# EAGLE design odessa_rev_A (EAGLE 6.6.0)
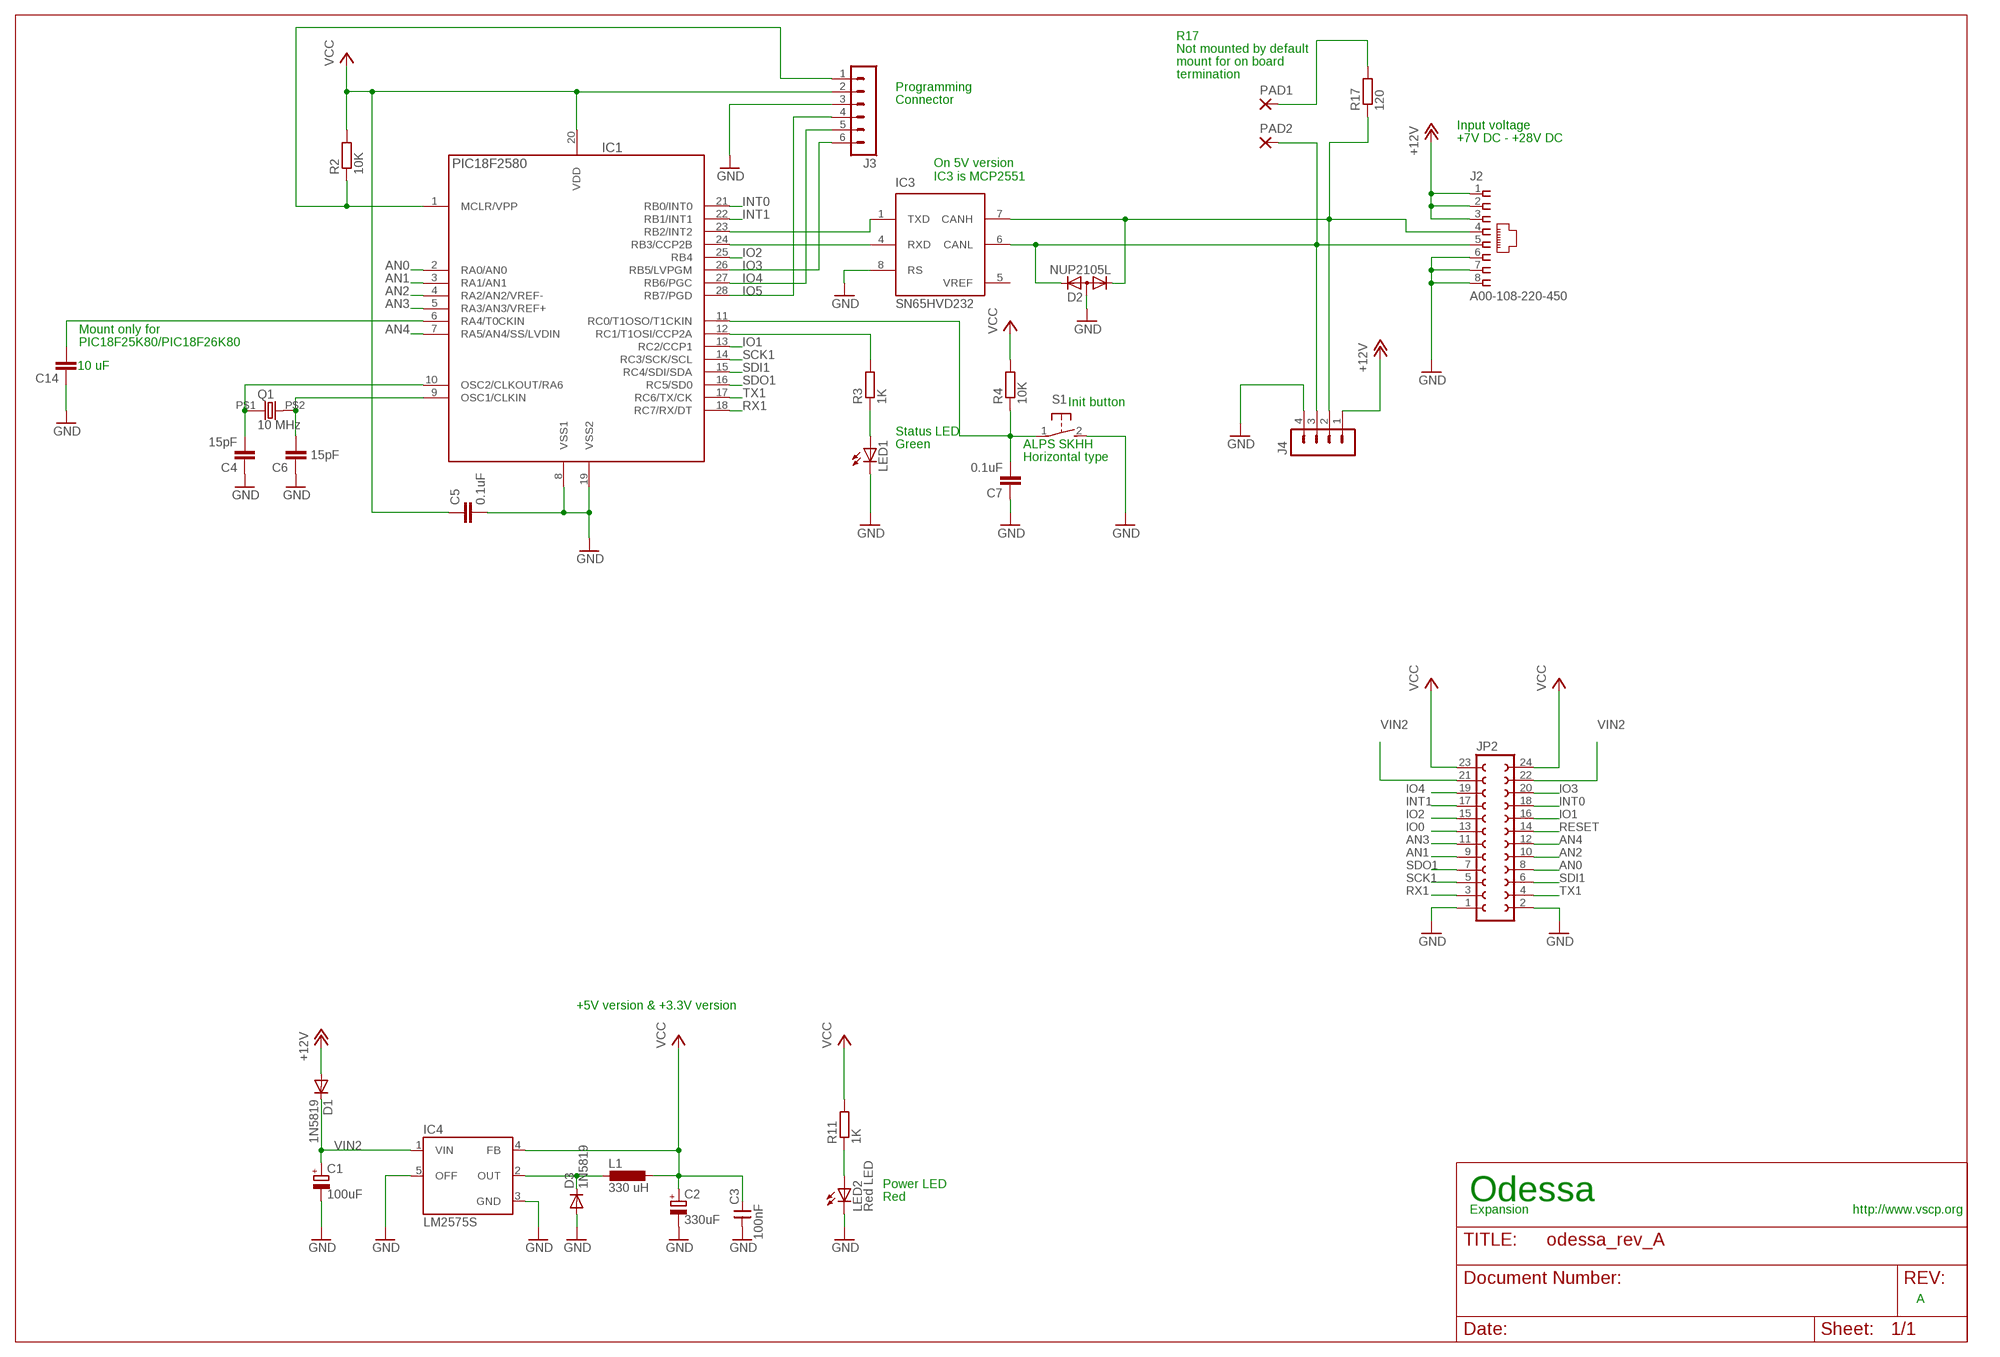
[diagram p0: schematic, sheet 1]

## Parts
C1  100uF  CPOL-EUD  [PANASONIC_D]
C2  330uF  CPOL-EUD  [PANASONIC_D]
C3  100nF  CNP-0805  [0805]
C4  15pF  C-EUC0805  [C0805]
C5  0.1uF  C-EUC0805  [C0805]
C6  15pF  C-EUC0805  [C0805]
C7  0.1uF  C-EUC0805  [C0805]
C14  10 uF  C-EUC0805  [C0805]
D1  1N5819  DIODE-SOD123  [SOD123]
D2  NUP2105L  DIODE-2CA|ACSOT23  [SOT23]
D3  1N5819  DIODE-SOD123  [SOD123]
IC1  PIC18F2580  PIC18LF252-I/SO  [SO28]
IC3  SN65HVD232  MCP2551SN  [SO-08]
IC4  LM2575S  [TO263-5]
J2  A00-108-220-450  [RJ-45]
J3  MA06-1  [MA06-1]
J4  MA04-1  [MA04-1]
JP2  FE12-2  [FE12-2]
L1  330 uH  DO3316P  [DO3316P]
LED1  LEDCHIP-LED0805  [CHIP-LED0805]
LED2  Red LED  LEDCHIP-LED0805  [CHIP-LED0805]
PAD1  1,6/0,8  [1,6/0,8]
PAD2  1,6/0,8  [1,6/0,8]
Q1  10 MHz  HC-49S  [9C]
R2  10K  R-EU_R0805  [R0805]
R3  1K  R-EU_R0805  [R0805]
R4  10K  R-EU_R0805  [R0805]
R11  1K  R-EU_R0805  [R0805]
R17  120  R-EU_R0805  [R0805]
S1  31-XX  [B3F-31XX]

## Nets
+12V: D1.A J2.1 J2.2 J2.3 J4.1
AN0: IC1.2(RA0/AN0) JP2.8
AN1: IC1.3(RA1/AN1) JP2.9
AN2: IC1.4(RA2/AN2/VREF-) JP2.10
AN3: IC1.5(RA3/AN3/VREF+) JP2.11
AN4: IC1.7(RA5/AN4/SS/LVDIN) JP2.12
CANL: D2.2(K2) IC3.6(CANL) J2.5 J4.3 PAD2.1(P)
GND: C1.- C2.- C3.1 C4.1 C5.2 C6.1 C7.1 C14.1 D2.3(A) D3.A IC1.8(VSS1) IC1.19(VSS2) IC3.8(RS) IC4.3(GND) IC4.5(OFF) J2.6 J2.7 J2.8 J3.3 J4.4 JP2.1 JP2.2 LED1.C LED2.C S1.2(S)
INT0: IC1.21(RB0/INT0) JP2.18
INT1: IC1.22(RB1/INT1) JP2.17
IO0: JP2.13
IO1: IC1.13(RC2/CCP1) JP2.16
IO2: IC1.25(RB4) JP2.15
IO3: IC1.26(RB5/LVPGM) J3.6 JP2.20
IO4: IC1.27(RB6/PGC) J3.5 JP2.19
IO5: IC1.28(RB7/PGD) J3.4
N$1: D3.C IC4.2(OUT) L1.1
N$2: C4.2 IC1.10(OSC2/CLKOUT/RA6) Q1.P$1
N$3: C14.2 IC1.6(RA4/T0CKIN)
N$4: IC1.12(RC1/T1OSI/CCP2A) R3.2
N$5: LED1.A R3.1
N$6: C7.2 IC1.11(RC0/T1OSO/T1CKIN) R4.1 S1.1(P)
N$7: C6.2 IC1.9(OSC1/CLKIN) Q1.P$2
N$11: PAD1.1(P) R17.2
N$20: LED2.A R11.1
N$22: D2.1(K1) IC3.7(CANH) J2.4 J4.2 R17.1
RESET: IC1.1(MCLR/VPP) J3.1 JP2.14 R2.1
RX1: IC1.18(RC7/RX/DT) JP2.3
RXCAN: IC1.24(RB3/CCP2B) IC3.4(RXD)
SCK1: IC1.14(RC3/SCK/SCL) JP2.5
SDI1: IC1.15(RC4/SDI/SDA) JP2.6
SDO1: IC1.16(RC5/SD0) JP2.7
TX1: IC1.17(RC6/TX/CK) JP2.4
TXCAN: IC1.23(RB2/INT2) IC3.1(TXD)
VCC: C2.+ C3.2 C5.1 IC1.20(VDD) IC4.4(FB) J3.2 JP2.23 JP2.24 L1.2 R2.2 R4.2 R11.2
VIN2: C1.+ D1.C IC4.1(VIN) JP2.21 JP2.22

## Notes on the sheet
- R17
- Not mounted by default
- mount for on board
- termination
- Programming
- Connector
- Input voltage
- +7V DC - +28V DC
- On 5V version 
  IC3 is MCP2551
- Mount only for
- PIC18F25K80/PIC18F26K80
- Init button
- Status LED
- Green | ALPS SKHH
- Horizontal type
- +5V version & +3.3V version
- Power LED
- Red | Odessa
- Expansion | http://www.vscp.org
- A

## Power pins joined to a net without a drawn wire
GND: IC3.2(VSS)
VCC: IC3.3(VDD)
VREF: IC3.5(VREF)

## Library data of the parts
C1 C2 = rcl:CPOL-EU: POLARIZED CAPACITOR, European symbol
C3 = cap-master:CNP-: NON-POLARIZED CAP
C4-C7 C14 = rcl:C-EU: CAPACITOR, European symbol
D1 D3 = diode:DIODE-: DIODE
D2 = diode:DIODE-2CA|AC: Dual DIODE Cathode-Anode|Anode-Cathode
IC1 = pic_olin:PIC18*F252-?: 18F252, 28 pin, 32Kb prog, 1536 data, 256 EEPROM
IC3 = microchip_can:MCP2551: High Speed CAN tranceiver
IC4 = v-reg-3:LM2575: National Semiconductor <http://www.national.com> 1.0A "Simple Switcher"(c) 52kHz, Vout 1.23-37V (HV: 57V), Vin 40V (HV: 60V), 50µA standby current
J2 = vscpcan:A00-108-220-450
J3 = con-lstb:MA06-1: PIN HEADER; OC_FARNELL: unknown; OC_NEWARK: unknown
J4 = con-lstb:MA04-1: PIN HEADER; OC_FARNELL: unknown; OC_NEWARK: unknown
JP2 = con-lsta:FE12-2: FEMALE HEADER; OC_FARNELL: unknown; OC_NEWARK: unknown
L1 = inductor-coilcraft:DO3316P: COILCRAFT; OC_FARNELL: unknown; OC_NEWARK: unknown
LED1 LED2 = led:LED: LED OSRAM: - CHIPLED LG R971, LG N971, LY N971, LG Q971, LY Q971, LO R971, LY R971 LH N974, LH R974 LS Q976, LO Q976, LY Q976 LO Q996 - Hyper CHIPLED LW Q18S LB Q993, LB Q99A, LB R99A - SideLED LS A670, LO A670, LY A670, LG A670, LP A670 LB A673, LV A673, LT A673, LW A673 LH A674 LY A675 LS A676, LA A676, LO A676, LY A676, LW A676 LS A679, LY A679, LG A679 - Hyper Micro SIDELED® LS Y876, LA Y876, LO Y876, LY Y876 LT Y87S - SmartLED LW L88C, LW L88S LB L89C, LB L89S, LG L890 LS L89K, LO L89K, LY L89K LS L896, LA L896, LO L896, LY L896 - TOPLED LS T670, LO T670, LY T670, LG T670, LP T670 LSG T670, LSP T670, LSY T670, LOP T670, LYG T670 LG T671, LOG T671, LSG T671 LB T673, LV T673, LT T673, LW T673 LH T674 LS T676, LA T676, LO T676, LY T676, LB T676, LH T676, LSB T676, LW T676 LB T67C, LV T67C, LT T67C, LS T67K, LO T67K, LY T67K, LW E67C LS E67B, LA E67B, LO E67B, LY E67B, LB E67C, LV E67C, LT E67C LW T67C LS T679, LY T679, LG T679 LS T770, LO T770, LY T770, LG T770, LP T770 LB T773, LV T773, LT T773, LW T773 LH T774 LS E675, LA E675, LY E675, LS T675 LS T776, LA T776, LO T776, LY T776, LB T776 LHGB T686 LT T68C, LB T68C - Hyper Mini TOPLED® LB M676 - Mini TOPLED Santana® LG M470 LS M47K, LO M47K, LY M47K Source: http://www.osram.convergy.de LUXEON: - LUMILED® LXK2-PW12-R00, LXK2-PW12-S00, LXK2-PW14-U00, LXK2-PW14-V00 LXK2-PM12-R00, LXK2-PM12-S00, LXK2-PM14-U00 LXK2-PE12-Q00, LXK2-PE12-R00, LXK2-PE12-S00, LXK2-PE14-T00, LXK2-PE14-U00 LXK2-PB12-K00, LXK2-PB12-L00, LXK2-PB12-M00, LXK2-PB14-N00, LXK2-PB14-P00, LXK2-PB14-Q00 LXK2-PR12-L00, LXK2-PR12-M00, LXK2-PR14-Q00, LXK2-PR14-R00 LXK2-PD12-Q00, LXK2-PD12-R00, LXK2-PD12-S00 LXK2-PH12-R00, LXK2-PH12-S00 LXK2-PL12-P00, LXK2-PL12-Q00, LXK2-PL12-R00 Source: www.luxeon.com KINGBRIGHT: KA-3528ASYC Source: www.kingbright.com
PAD1 PAD2 = wirepad:1,6/0,8: THROUGH-HOLE PAD
Q1 = vscpcan:HC-49S: Digikey 887-1050-1-nd
R2-R4 R11 R17 = rcl:R-EU_: RESISTOR, European symbol
S1 = switch-omron:31-XX: OMRON SWITCH; MPN: B3F-3100; OC_FARNELL: 959704; OC_NEWARK: 36M3582

## Board
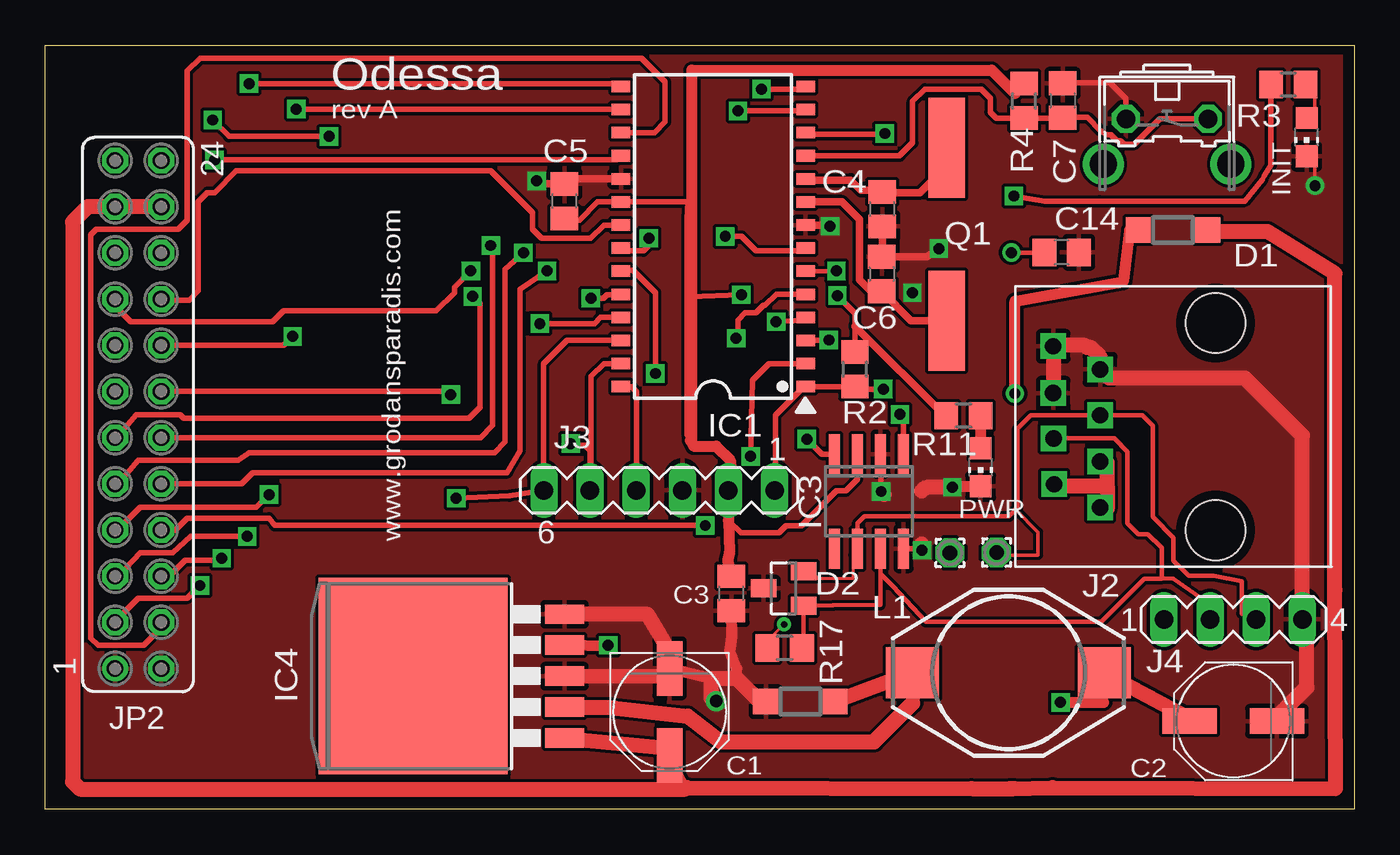
[diagram p1: board, top side]
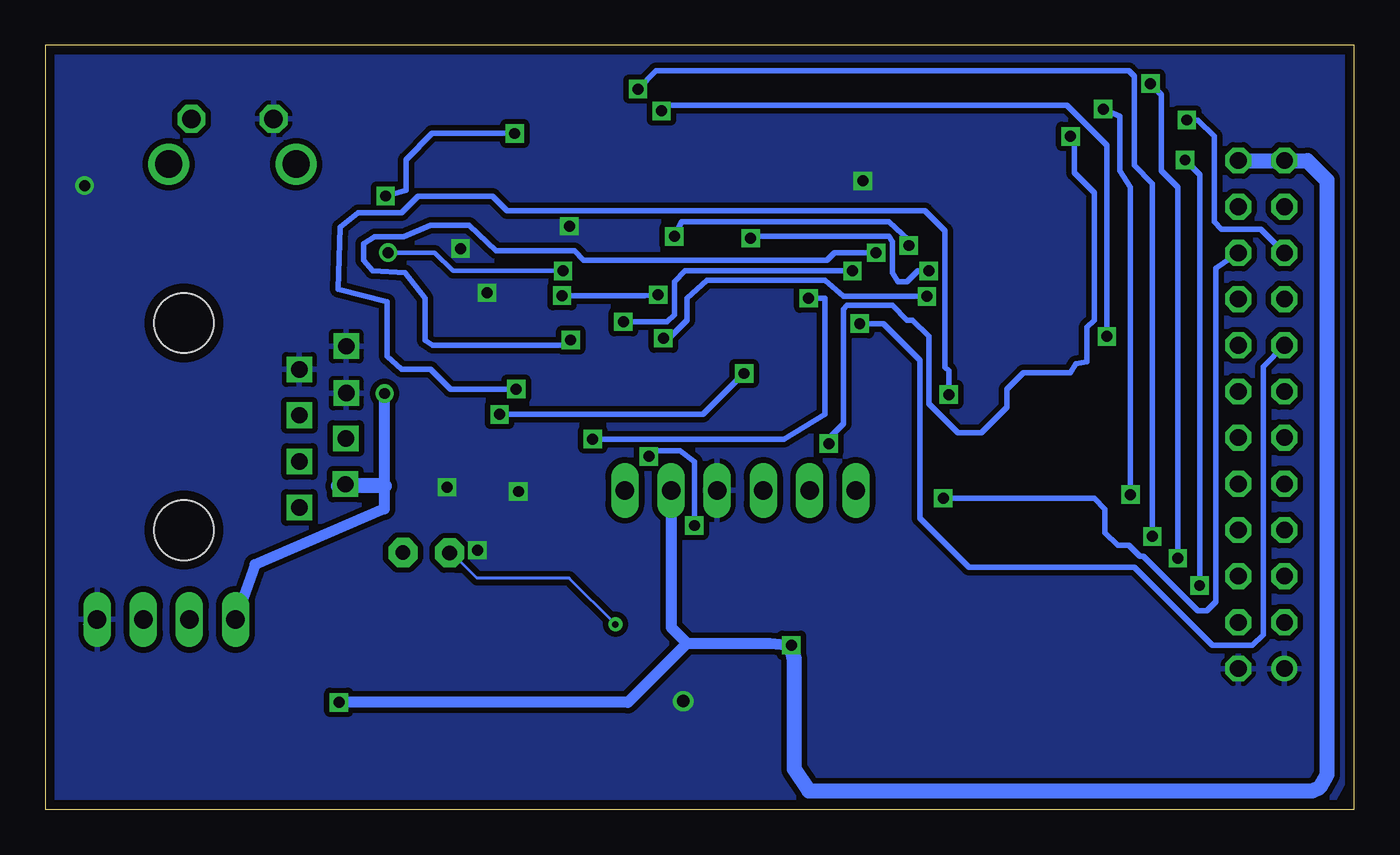
[diagram p2: board, bottom side, seen from below]

Size 72 x 42 mm. Coordinates in mm from the lower left corner, seen from the top.
Outline: 0,0 0,42 72,42 72,0 0,0
Copper layers (1*16): Top 0.0356mm / dielectric 1.5011mm / Bottom 0.0356mm
Design rules "SilverCircuits": minimum track width 7mil, minimum drill 14mil, track to track 7mil, track to pad 7mil, pad to pad 7mil, via to via 7mil, smd to smd 0mil, copper to edge 20mil, drill to drill 8mil, minimum pad ring 10mil, minimum via ring 8mil, stop-mask expansion 4mil, vias tented up to drill 0mil, thermal gap 10mil

### Footprints (pad centres in the part's own frame; a part is rotated, then mirrored left to right if it is on the bottom)
PANASONIC_D = smd 3 x 1.4: + 2.4,0; - -2.4,0
0805 = smd 1.27 x 1.524: 1 -0.953,0; 2 0.953,0
C0805 = smd 1.3 x 1.5: 1 -0.95,0; 2 0.95,0
SOD123 = smd 1.4 x 1.4: A 1.9,0; C -1.9,0
SOT23 = smd 1 x 1.4: 1 -0.95,-1.1; 2 0.95,-1.1; 3 0,1.1
SO28 = smd 0.635 x 1.016: 1 -8.255,-5.08; 2 -6.985,-5.08; 3 -5.715,-5.08; 4 -4.445,-5.08; 5 -3.175,-5.08; 6 -1.905,-5.08; 7 -0.635,-5.08; 8 0.635,-5.08; 9 1.905,-5.08; 10 3.175,-5.08; 11 4.445,-5.08; 12 5.715,-5.08; 13 6.985,-5.08; 14 8.255,-5.08; 15 8.255,5.08; 16 6.985,5.08; 17 5.715,5.08; 18 4.445,5.08; 19 3.175,5.08; 20 1.905,5.08; 21 0.635,5.08; 22 -0.635,5.08; 23 -1.905,5.08; 24 -3.175,5.08; 25 -4.445,5.08; 26 -5.715,5.08; 27 -6.985,5.08; 28 -8.255,5.08
SO-08 = smd 0.6 x 2.2: 1 -1.905,-2.6; 2 -0.635,-2.6; 3 0.635,-2.6; 4 1.905,-2.6; 5 1.905,2.6; 6 0.635,2.6; 7 -0.635,2.6; 8 -1.905,2.6
TO263-5 = smd 1.067 x 2.159: 1 -3.404,-5.791; 2 -1.702,-5.791; 3 0,-5.791; 4 1.702,-5.791; 5 3.404,-5.791 | smd 10.8 x 10.41: 6 0,2.54
RJ-45 = drill 0.9 square: 1 -4.45,6.35; 2 -3.17,8.89; 3 -1.92,6.36; 4 -0.65,8.91; 5 0.62,6.35; 6 1.84,8.93; 7 3.14,6.35; 8 4.42,8.93 | hole 3.3: -5.7,0; 5.7,0
MA06-1 = drill 1.016 long: 1 -6.35,0; 2 -3.81,0; 3 -1.27,0; 4 1.27,0; 5 3.81,0; 6 6.35,0
MA04-1 = drill 1.016 long: 1 -3.81,0; 2 -1.27,0; 3 1.27,0; 4 3.81,0
FE12-2 = drill 0.914: 1 -13.97,1.27 | drill 0.914 octagon: 2 -13.97,-1.27; 3 -11.43,1.27; 4 -11.43,-1.27; 5 -8.89,1.27; 6 -8.89,-1.27; 7 -6.35,1.27; 8 -6.35,-1.27; 9 -3.81,1.27; 10 -3.81,-1.27; 11 -1.27,1.27; 12 -1.27,-1.27; 13 1.27,1.27; 14 1.27,-1.27; 15 3.81,1.27; 16 3.81,-1.27; 17 6.35,1.27; 18 6.35,-1.27; 19 8.89,1.27; 20 8.89,-1.27; 21 11.43,1.27; 22 11.43,-1.27; 23 13.97,1.27; 24 13.97,-1.27
DO3316P = smd 2.92 x 2.79: 1 -5.28,0; 2 5.28,0
CHIP-LED0805 = smd 1.2 x 1.2: A 0,-1.05; C 0,1.05
1,6/0,8 = drill 0.813 pad 1.6 octagon: 1 0,0
9C = smd 5.5 x 2: P$1 -4.74,0; P$2 4.76,0
R0805 = smd 1.3 x 1.5: 1 -0.95,0; 2 0.95,0
B3F-31XX = drill 1.016 octagon: 1 -2.261,-1.245; 2 2.261,-1.245 | drill 1.499 pad 2.159: 3 -3.505,1.245; 4 3.505,1.245

### Placement (x,y rotation side)
C1  34.34,5.34 270 top
C2  65.36,4.84 180 top
C3  37.74,11.86 90 top
C4  46.04,33 90 top
C5  28.55,33.44 90 top
C6  46.01,29.43 270 top
C7  55.97,38.97 270 top
C14  55.91,30.62 180 top
D1  62.04,31.86 180 top
D2  40.61,12.14 90 top
D3  41.53,5.91 180 top
IC1  36.74,31.49 90 top
IC3  45.31,16.93 180 top
IC4  22.77,7.31 90 top
J2  64.38,21.04 90 top
J3  33.77,17.53 180 top
J4  65.35,10.43 0 top
JP2  5.1,21.7 90 top
L1  52.99,7.5 0 top
LED1  69.39,36.96 180 top
LED2  51.45,18.8 180 top
PAD1  49.76,14.09 0 top
PAD2  52.33,14.11 0 top
Q1  49.58,31.63 270 top
R2  44.54,24.19 90 top
R3  68.38,39.85 180 top
R4  53.84,38.95 90 top
R11  50.51,21.64 180 top
R17  40.67,8.86 180 top
S1  61.71,36.72 180 top

### Tracks (layer width: path | path; a pad name or v marks a point on that pad's centre or on a via)
+12V  (via drill 0.6)
  Top 0.178: 59.69,31.75 59.66,31.86
  Top 0.203: J2.2 55.88,17.78 | 58.42,16.51 J2.1 | 59.69,31.75 D1.A
  Top 0.406: D1.A 59.82,31.84
  Top 0.61: 60.01,31.97 59.66,31.86 59.67,31.77 59.33,29.06 59.27,29.01 53.34,27.94 v53.34,22.86
  Top 0.813: 55.88,17.78 58.42,17.78 | 58.42,17.78 58.42,19.05 J2.3 | 58.42,17.78 58.42,16.51
  Bottom 0.203: 55.88,17.78 J2.2
  Bottom 0.61: v53.34,22.86 53.34,17.78 53.34,16.51 60.47,13.44 J4.1
  Bottom 0.813: 53.34,17.78 55.88,17.78
AN0  (via drill 0.6)
  Top 0.305: JP2.8 7.15,15.35 7.8,16 12.3,16 12.6,15.6 v36.3,15.6 | v38.8,19.4 38.9,23.6 39.8,24.5 IC1.2
  Bottom 0.305: v36.3,15.6 36.3,19.1 37.1,19.7 38.5,19.7 v38.8,19.4
AN1  (via drill 0.6)
  Top 0.305: JP2.9 3.99,17.89 5.1,19.2 10.6,19.2 11.2,19.6 24.7,19.6 25.3,20.2 25.3,29.7 v26.3,30.6 | v43.1,25.8 41.84,25.8 IC1.3
  Bottom 0.305: v26.3,30.6 28.6,30.6 29,30.2 42.4,30.2 42.9,30.7 47.2,30.7 48.7,32.1 50.8,32.1 52.3,31.49 53.9,31.49 54.5,31.1 54.5,30.2 54,29.6 52.2,29.5 51.1,28.1 51.1,25.8 50.7,25.5 43.4,25.5 v43.1,25.8
AN2  (via drill 0.6)
  Top 0.305: JP2.10 10.79,17.89 11.4,18.5 25.4,18.5 26.1,19.7 26.1,28.6 v27.6,29.6 | v40.2,26.8 41.67,26.9 IC1.4
  Bottom 0.305: v27.6,29.6 36.8,29.6 37.4,29 37.4,27.2 37.8,26.8 v40.2,26.8
AN3  (via drill 0.6)
  Top 0.305: JP2.11 3.93,20.43 5,21.7 7.4,21.7 7.6,21.5 23.3,21.5 23.9,22.1 23.9,27.8 v23.5,28.2 | IC1.5 40.22,28.32 39.6,27.7 39.5,27.7 39.1,27.3 38.5,27.3 38.1,26.9 38.1,26 v38,25.9
  Bottom 0.305: v23.5,28.2 28.1,28.2 29.1,29.1 35.6,29.1 36.7,28.1 36.7,26.9 37.7,25.9 v38,25.9
AN4  (via drill 0.6)
  Top 0.305: JP2.12 23.93,20.43 24.6,21.1 24.6,30.5 v24.5,31 | v37.4,31.5 38.3,31.5 39.1,30.7 41.66,30.7 IC1.7
  Bottom 0.305: v24.5,31 24.5,31.3 25.6,32.3 37,32.3 v37.4,31.5
CANL
  Top 0.178: 44.45,13.97 44.45,12.7 41.91,12.7 D2.2
  Top 0.203: D2.2 42.45,12.74 | 44.45,13.97 IC3.6 | PAD2.1 52.07,13.97 54.61,13.97 54.61,15.24 53.38,16.46 53.34,16.51
  Top 0.254: J4.3 65.81,10.75 65.81,12.53 64.29,12.83 62.9,12.83 62.06,13.67 62.06,14.93 60.92,16.07 60.92,21.09 60.35,21.66 J2.5 54.21,21.66 53.48,20.93 53.48,16.56 53.38,16.46 53.02,16.1 45.06,16.1 44.67,15.71 IC3.6
GND  (via drill 0.6, 0.7)
  Top 0.203: v69.85,34.29 69.85,35.56 LED1.C
  Top 0.254: 36.63,7.18 36.63,7.36
  Top 0.305: IC3.8 48.14,14.33 v48.23,14.24 | v45.98,17.47 45.98,19.5 IC3.2 | S1.2 59.45,39.06 58.55,39.96 56.01,39.96 C7.1
  Top 0.406: IC1.19 28.82,34.66 C5.2 27.19,34.39 v27.03,34.55 | 45.97,32.12 C4.1 46.04,30.41 C6.1 48.51,30.38 v49.16,30.83 | IC1.8 43.1,32.12 v43.17,32.06
  Top 0.61: 34.05,7.32 34.33,6.65 34.62,7.21 34.65,7.18 | 34.65,7.18 34.7,7.13 | 34.65,7.18 C1.- | 39.42,5.79 39.33,5.88 D3.A 39.48,5.91 | C1.- 36.63,7.18 | 39.48,5.91 39.58,5.81 | 39.48,5.91 38.93,6.46 | 34.44,7.15 34.34,7.05 | C1.- 34.44,7.15 | 34.47,8.45 34.47,7.18 34.44,7.15 | 36.63,6.09 v36.91,5.94 | 38.02,7.18 38.02,7.75 37.66,8.68 37.76,9.48 C3.1 | 49.95,17.75 LED2.C
  Top 0.813: IC4.3 34.05,7.32 | 39.33,5.88 38.02,7.18 36.63,7.18 36.63,6.09 | IC4.5 33.14,10.71 34.47,8.45 | C2.- 67.76,5.06 69.4,6.7 69.4,10.19 J4.4 69.16,20.54 66,23.7 58.51,23.7 J2.7 58.03,24.87 57.5,25.4 57.3,25.4 57.2,25.5 55.49,25.5 J2.8 J2.6 | v49.9,17.7 48.5,17.7 48.2,17.5 | 46.15,17.3 v45.98,17.47 | 48.2,14.57 v48.23,14.24
  Bottom 0.178: 43.18,31.75 v43.17,32.06 | J4.4 69.85,10.16 69.26,10.33
  other vias: 47.7,28.4
  pour Bottom (isolate 0.305): 0.5,1.58 1.26,0.23 71.64,0.46 71.48,1.13 71.5,34.3 71.42,41.86 0.33,41.86 0.51,33.68
  pour Top: 0.57,41.92 0.56,41.52 0.56,0.32 71.6,0.32 71.6,0.81 71.28,0.81 71.28,41.6 2.5,41.9 2.1,41.85
INT0
  Top 0.305: IC1.21 30.73,32.12 30,31.4 27.3,31.4 26.8,31.9 26.8,32.8 24.5,35.1 10.5,35.1 9.3,33.9 8.9,33.9 8.4,33.4 8.4,28.5 7.9,28 6.42,28 JP2.18
INT1  (via drill 0.6)
  Top 0.305: JP2.17 3.83,27.67 4.7,26.8 12.5,26.8 13.1,27.4 21.5,27.4 22.5,28.4 22.5,28.7 v23.4,29.6 | v33.2,31.4 33.2,31 32.9,30.7 31.82,30.7 IC1.22
  Bottom 0.305: v23.4,29.6 24,29.6 24.6,29 25.1,29 25.4,29.5 25.4,31.2 25.6,31.5 32.8,31.5 v33.2,31.4
IO1  (via drill 0.6)
  Top 0.305: JP2.16 13.11,25.51 v13.6,26 | v38.1,38.4 41.74,38.4 IC1.13
  Bottom 0.305: v13.6,26 13.6,36.5 15.8,38.7 37.8,38.7 v38.1,38.4
IO2  (via drill 0.6)
  Top 0.305: IC1.25 30.55,27.05 30.2,26.7 v27.2,26.7
  Bottom 0.305: v27.2,26.7 25.9,26.7 23.9,24.7 23.9,16 21.2,13.3 12.1,13.3 7.8,9 5.6,9 5,9.6 5,24.34 JP2.15
IO3  (via drill 0.6)
  Top 0.305: IC1.26 28.68,25.77 27.41,24.5 J3.6 25.53,17.23 v22.6,17.1
  Bottom 0.305: v22.6,17.1 14.3,17.1 13.7,16.5 13.7,15.2 13,14.5 12.4,14.5 11.8,13.9 11.6,13.9 8.6,10.9 8.1,10.9 7.6,11.4 7.6,29.76 JP2.20
IO4  (via drill 0.6)
  Top 0.305: IC1.27 30.73,24.5 30.03,23.8 30.03,17.6 J3.5 29.96,19.74 29.7,20 29,20 v28.9,20.1 | v15.6,37 10.1,37 v9.2,37.9
  Bottom 0.305: v28.9,20.1 28.9,20.4 28.1,21.2 28.1,27.5 27.9,27.7 25.4,27.7 24.6,26.9 24.3,26.9 23.4,26 23.4,22.3 21.8,20.7 20.5,20.7 19.1,22.1 19.1,23.1 18.2,24 15.6,24 15.3,24.5 14.7,24.6 14.7,26.5 14.3,26.9 14.3,33.9 15.4,35 15.4,36.8 v15.6,37 | v9.2,37.9 8.6,37.9 7.7,37 7.7,32.3 7.3,31.9 5.14,31.9 JP2.19
IO5
  Top 0.305: IC1.28 32.24,23.23 32.52,22.96 32.52,17.55 J3.4
N$1
  Top 0.61: 47.83,5.86 47.78,5.91 L1.1 47.71,5.81 | IC4.2 29.15,5.65 29.03,5.59
  Top 0.813: L1.1 D3.C | 47.71,5.81 45.6,3.7 37.16,3.7 35.35,5.11 30.92,5.6 28.61,5.6 29.15,5.65
N$2
  Top 0.406: Q1.P$1 49.58,35.37 48.1,33.89 45.66,33.89 45.52,34.03 | 45.52,34.03 45.96,34.03 C4.2 | 45.52,34.03 44.87,34.03 44.3,34.6 41.88,34.6 IC1.10
N$3  (via drill 0.6)
  Top 0.254: IC1.6 43.52,29.59 v43.52,29.6 | v53.15,30.61 C14.2
  Bottom 0.254: v43.52,29.6 49.58,29.6 50.58,30.6 v53.14,30.6 v53.15,30.61
N$4  (via drill 0.6)
  Top 0.305: IC1.12 41.92,37.2 42.01,37.12 46.14,37.12 v46.18,37.16 | v53.28,33.72 54.98,33.42 58,33.44 65.98,33.44 66.96,34.62 67.06,34.84 67.43,35.41 R3.2
  Bottom 0.305: v46.18,37.16 50.73,37.16 52.17,35.72 52.17,34.03 v53.28,33.72
N$5
  Top 0.203: 69.85,39.37 69.85,38.1 LED1.A
  Top 0.254: 69.85,39.37 R3.1
N$6
  Top 0.305: IC1.11 41.84,35.92 46.99,35.92 47.71,36.64 47.71,38.92 48.39,39.6 51.49,39.6 51.98,39.11 51.98,38.33 52.31,38 R4.1 55.95,38 C7.2 55.99,38.04 57.32,38.04 58.07,37.29 58.13,37.29 58.33,37.09 58.62,37.09 58.95,36.76 59.14,36.76 59.33,36.57 59.92,36.57 61.31,37.97 S1.1
N$7
  Top 0.406: Q1.P$2 47.62,26.87 C6.2 45.41,28.48 44.78,29.11 44.78,32.45 43.83,33.4 IC1.9
N$11  (via drill 0.36)
  Top 0.178: v40.64,10.16 39.37,8.89 R17.2
  Bottom 0.178: v40.64,10.16 43.18,12.7 48.26,12.7 49.53,13.97 PAD1.1
N$20
  Top 0.61: R11.1 LED2.A
N$22
  Top 0.254: 45.95,12.95 IC3.7 | 45.95,12.95 46.61,12.28 48.43,10.3 58.1,10.3 60.46,12.66 61.37,12.66 61.41,12.7 | 61.41,12.7 61.41,14.38 60.66,15.13 60.12,15.13 59.53,15.72 59.53,19.66 58.8,20.39 J2.4 | 61.41,12.7 62.05,12.66 63.78,11.47 J4.2 | 45.95,12.95 45.93,12.93 45.93,11.23 43.34,11.2 D2.1 41.71,8.95 R17.1
  Top 0.305: IC3.7 45.92,14.3
RESET  (via drill 0.6)
  Top 0.305: IC1.1 R2.1 | R2.1 41.74,23.24 40.16,21.66 40.16,17.57 J3.1 | JP2.14 22.13,22.97 v22.3,22.8 | v46.1,23.1 44.68,23.1 R2.1
  Bottom 0.305: v22.3,22.8 22.3,24.1 22.5,24.3 22.5,31.8 23.6,32.9 46.6,32.9 47.4,33.7 51.5,33.7 52.4,32.8 54.8,32.8 55.8,32 55.9,28.6 53.2,27.9 53.2,24.9 52.4,24.2 50.8,24.2 49.7,23.1 v46.1,23.1
RX1  (via drill 0.6)
  Top 0.305: JP2.3 3.83,10.33 5.1,11.6 7.8,11.6 v8.5,12.3 | v9.3,35.7 31.43,35.7 IC1.18
  Bottom 0.305: v8.5,12.3 8.5,34.9 v9.3,35.7
RXCAN  (via drill 0.6)
  Top 0.305: IC3.4 42.71,19.53 v41.89,20.35 | v30.01,28.1 30.7,28.1 30.9,28.3 31.64,28.3 IC1.24
  Bottom 0.305: v41.89,20.35 31.37,20.35 29.1,21.72 29.1,28.09 v30.01,28.1
SCK1  (via drill 0.6)
  Top 0.305: JP2.5 4.01,12.81 5.2,14.1 7,14.1 8,15 v11.1,15 | v39.4,39.6 41.67,39.6 IC1.14
  Bottom 0.305: v11.1,15 11.1,34.4 12.1,35.4 12.1,40.3 12.4,40.6 38.4,40.6 v39.4,39.6
SDI1  (via drill 0.6)
  Top 0.305: JP2.6 6.81,12.81 7.7,13.7 9.6,13.7 v9.7,13.8 | v11.2,39.9 31.5,39.9 IC1.15
  Bottom 0.305: v9.7,13.8 9.7,34.2 10.6,35.1 10.6,39.3 v11.2,39.9
SDO1  (via drill 0.6)
  Top 0.305: JP2.7 3.95,15.35 5.2,16.6 11.6,16.6 v12.3,17.3 | v13.8,38.5 31.04,38.5 IC1.16
  Bottom 0.305: v12.3,17.3 12.3,34.2 12.9,35.1 12.9,38.1 v13.8,38.5
TX1
  Top 0.305: JP2.4 6.37,9.97 5.4,9 2.9,9 2.5,9.4 2.5,31.6 2.8,31.9 7.3,31.9 7.8,32.4 7.8,40.6 8.5,41.3 32.8,41.3 34.1,40 34.1,37.8 33.5,37.2 IC1.17
TXCAN  (via drill 0.6)
  Top 0.305: IC3.1 47.22,21.5 v47.01,21.71 | v33.56,23.96 33.56,28.41 32.32,29.65 31.73,29.65 IC1.23
  Bottom 0.305: v47.01,21.71 35.81,21.71 v33.56,23.96
VCC  (via drill 0.6)
  Top 0.178: 43.58,28.14 v43.58,28.24
  Top 0.203: 49.53,21.59 R11.2 | 44.54,26.67 44.55,26.57
  Top 0.254: 35.48,20.27 35.56,20.32
  Top 0.305: C5.1 28.65,32.39 29.38,32.39 30.39,33.4 IC1.20 35.37,33.4 35.3,32.48 35.3,28.08 | 35.3,28.08 35.3,20.58 35.48,20.27 | 37.68,17.63 J3.2 | v30.96,9.01 30.96,8.96 | IC3.3 44.67,18.14 44.03,17.5 43.51,17.5 41.59,15.58 40.74,15.58 40.35,15.19 38.26,15.19 37.58,15.87 | 58.23,5.87 L1.2 | R2.2 44.54,26.67 44.54,27.28 v43.58,28.24 | v38.29,28.29 35.41,28.19 35.3,28.08
  Top 0.406: 63.05,4.95 C2.+ | 44.55,26.57 49.53,21.59
  Top 0.61: 35.48,20.27 35.66,19.96 36.9,19.96 37.68,19.18 37.68,17.63 | 30.96,8.96 IC4.4 | C3.2 37.53,13.65 37.63,14.12 37.58,15.87 J3.2 | v55.85,5.87 58.23,5.87 | 35.56,20.32 35.56,40.64 52.07,40.64 53.34,39.37 R4.2
  Top 0.813: L1.2 63.05,4.95
  Bottom 0.305: v43.58,28.24 39.04,28.24 v38.29,28.29
  Bottom 0.61: J3.2 37.58,9.99 36.71,9.12 | 36.71,9.12 32.14,9.12 v30.96,9.01 | v55.85,5.87 39.96,5.87 36.71,9.12
  Bottom 0.813: JP2.23 JP2.24 2.57,35.67 1.5,34.6 1.5,1.9 1.9,1.2 2.3,1 30,1 30.8,2.2 30.8,8.25 v30.96,9.01
VIN2
  Top 0.406: 34.35,3.36 C1.+ 35.27,1.18 | D1.C 64.48,31.86 64.58,31.76
  Top 0.813: IC4.1 34.35,3.36 | 64.58,31.76 67.25,31.76 70.95,29.46 70.95,12.05 70.98,1.12 55.42,1.18 53.07,1.13 53.29,1.12 50.97,1.13 35.27,1.18 35.19,1.1 1.9,1.1 1.5,1.5 1.5,32.3 2.33,33.13 JP2.22 JP2.21

### Text on the board
tNames: Odessa | rev A | INIT | PWR | www.grodansparadis.com